# Altium schematic sheet Power_External_Connectors.SchDoc
size B
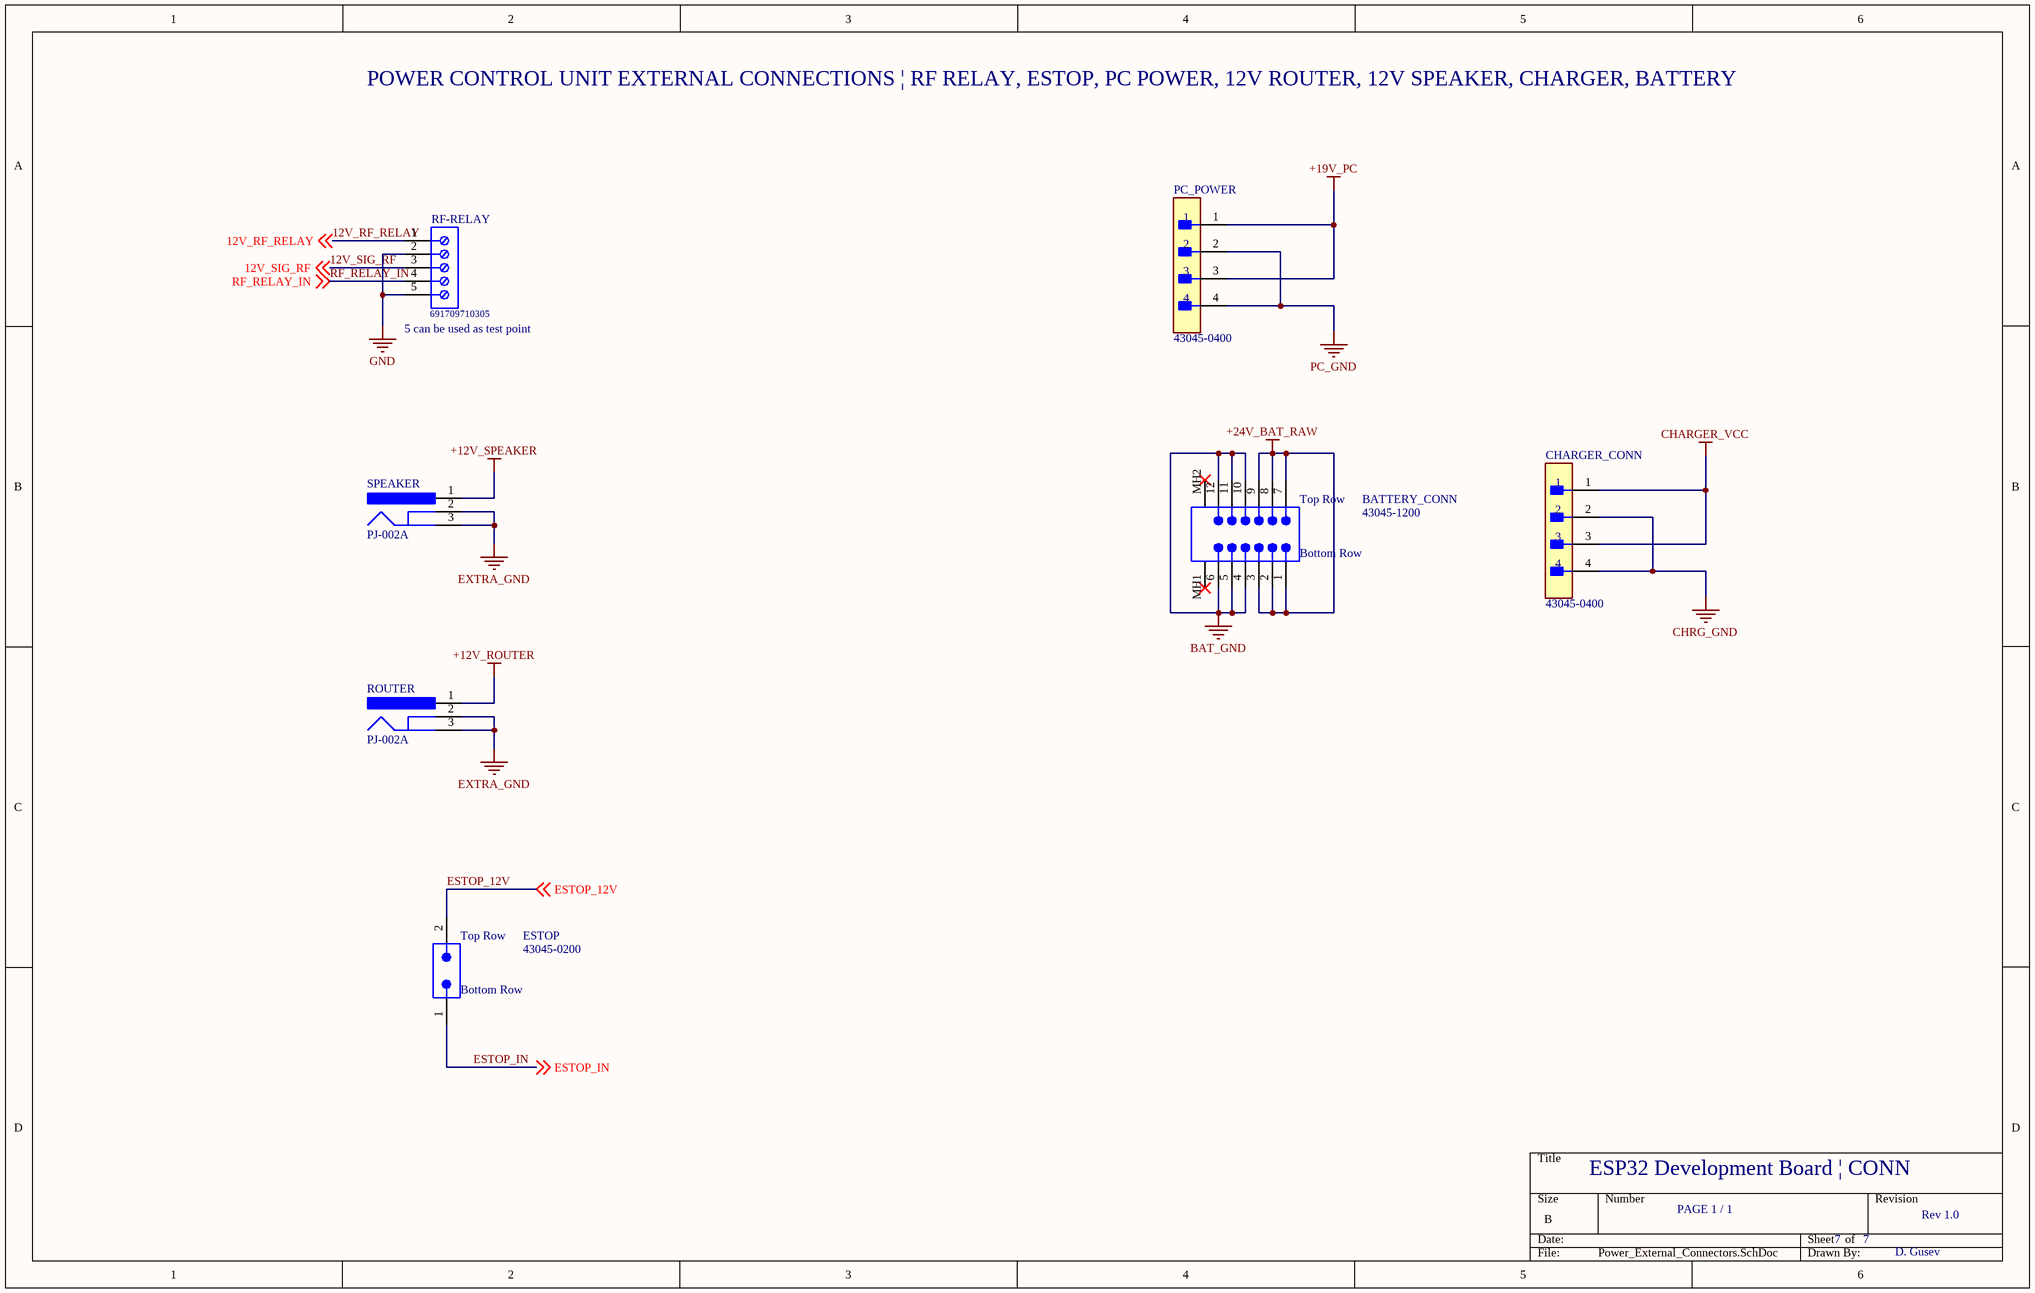
[diagram p0: Power_External_Connectors.SchDoc]

## Parts
BATTERY_CONN  43045-1200  [MOLX-43045-1200]
CHARGER_CONN  43045-0400  [FP-43045-0400-MFG]
ESTOP  43045-0200  [MOLX-43045-0200]
PC_POWER  43045-0400  [FP-43045-0400-MFG]
RF-RELAY  691709710305  [691709710305]
ROUTER  PJ-002A  [CUI-PJ-002A_V]
SPEAKER  PJ-002A  [CUI-PJ-002A_V]

## Nets
+12V_ROUTER: ROUTER.1
+12V_SPEAKER: SPEAKER.1
+19V_PC: PC_POWER.1 PC_POWER.3
+24V_BAT_RAW: BATTERY_CONN.1 BATTERY_CONN.2 BATTERY_CONN.3 BATTERY_CONN.7 BATTERY_CONN.8 BATTERY_CONN.9
BAT_GND: BATTERY_CONN.4 BATTERY_CONN.5 BATTERY_CONN.6 BATTERY_CONN.10 BATTERY_CONN.11 BATTERY_CONN.12
CHARGER_VCC: CHARGER_CONN.1 CHARGER_CONN.3
CHRG_GND: CHARGER_CONN.2 CHARGER_CONN.4
EXTRA_GND: ROUTER.2 ROUTER.3 SPEAKER.2 SPEAKER.3
GND: RF-RELAY.2 RF-RELAY.5
PC_GND: PC_POWER.2 PC_POWER.4
12V_RF_RELAY: RF-RELAY.1 ; off-sheet 12V_RF_RELAY
12V_SIG_RF: RF-RELAY.3 ; off-sheet 12V_SIG_RF
ESTOP_12V: ESTOP.2 ; off-sheet ESTOP_12V
ESTOP_IN: ESTOP.1 ; off-sheet ESTOP_IN
RF_RELAY_IN: RF-RELAY.4 ; off-sheet RF_RELAY_IN

Not connected (* = marked no-connect by the designer): BATTERY_CONN MH1* MH2*

## Notes on the sheet
- POWER CONTROL UNIT EXTERNAL CONNECTIONS | RF RELAY, ESTOP, PC POWER, 12V ROUTER, 12V SPEAKER, CHARGER, BATTERY
- (near RF-RELAY) 5 can be used as test point
- ESP32 Development Board | CONN
- PAGE 1 / 1
- 7
- Rev 1.0
- D. Gusev
- (in symbol Molex 0430450-200) Top Row; Bottom Row
- (in symbol Molex 0430451-200) Top Row; Bottom Row

## Library data of the parts
BATTERY_CONN = Molex 0430451-200: 3 mm Pitch Micro-Fit 3.0 Connector, 17.27 mm Mated Height, Vertical, Through Hole, 12 Circuits, -40 to 105 degC, RoHS, Tray; PartNumber: 43045-0812; Pitch: 3 mm; No. of Positions: 8; No. of Rows: 2; ComponentLink2Description: Datasheet; ComponentLink2URL: http://www.molex.com/webdocs/datasheets/pdf/en-us/0430450812_PCB_HEADERS.pdf; Orientation: Vertical; Packing: Tray; Temperature Min: -40 degC; RoHS: TRUE; ComponentLink3Description: Package Specification; Temperature Max: 105 degC; ComponentLink3URL: http://www.molex.com/pdm_docs/sd/430450812_sd.pdf; Mounting Technology: Through Hole; PackageVersion: Rev. F, 06/2009; ComponentLink1Description: Manufacturer URL; PackageDescription: 8-Pin PCB Header, Vertical, Pitch 3 mm, Mated Height 17.27 mm, Through Hole; ComponentLink1URL: http://www.molex.com/
CHARGER_CONN PC_POWER = CMP-04776-000002-1: CONN HEADER R/A 4POS 3MM; Manufacturer: Molex; Conn Gender: Male; Conn Orientation: Right Angle; Voltage Rating: 600V; Number Of Contacts: 4; Is Female: yes; Current Rating: 8.5A; ComponentLink2URL: https://www.molex.com/webdocs/datasheets/pdf/en-us/0430450400_PCB_HEADERS.pdf; Manufacturer Part Number: 43045-0400; Digikey Description: CONN HEADER R/A 4POS 3MM; Category: Conn; Temperature Range High: +105°C; Lead Free: Yes; Device Class L1: Connectors; Automotive: No; Temperature: -40°C to +105°C; Footprint Url: https://www.molex.com/pdm_docs/sd/430450400_sd.pdf; Height: 9.27mm; Number Of Rows: 2; Device Class L3: unset; Pitch: 3mm; Temperature Range Low: -40°C; Contact Material: Tin,Nickel; Octopart: https://octopart.com/43045-0400-molex-287063; RoHS: TRUE; ComponentLink2Description: Datasheet; Package: 43045-0400; Device Class L2: Headers and Wire Housings
ESTOP = Molex 0430450-200: 3 mm Pitch Micro-Fit 3.0 Connector, 17.27 mm Mated Height, Vertical, Through Hole, 2 Circuits, -40 to 105 degC, RoHS, Tray; PartNumber: 43045-0812; Pitch: 3 mm; No. of Positions: 8; No. of Rows: 2; ComponentLink2Description: Datasheet; ComponentLink2URL: http://www.molex.com/webdocs/datasheets/pdf/en-us/0430450812_PCB_HEADERS.pdf; Orientation: Vertical; Packing: Tray; Temperature Min: -40 degC; RoHS: TRUE; ComponentLink3Description: Package Specification; Temperature Max: 105 degC; ComponentLink3URL: http://www.molex.com/pdm_docs/sd/430450812_sd.pdf; Mounting Technology: Through Hole; PackageVersion: Rev. F, 06/2009; ComponentLink1Description: Manufacturer URL; PackageDescription: 8-Pin PCB Header, Vertical, Pitch 3 mm, Mated Height 17.27 mm, Through Hole; ComponentLink1URL: http://www.molex.com/
RF-RELAY = CMP-1502-03338-1: Serie 7097 - 5.00 mm Horizontal Entry SMT with Pressure Clamp WR-TBL, 5 pin; Manufacturer: Wurth Elektronik; Pitch: 5.00mm; Pin Number: 5; Packaging: TapeandReelwithCap; Operating Temperature: -45to130degC; Mounting Technology: SMT; Part Number: 691709710305; Publisher: WurthElektronik; Manufacturer URL: http://www.we-online.de; Datasheet URL: http://katalog.we-online.de/em/datasheet/6917097103xx.pdf; Package Reference: 691709710305
ROUTER SPEAKER = CMP-2000-06895-1: Through Hole Right Angle DC Power Jack, 2.5 A, 2 mm Center Pin, 3 Position, -25 to 85 degC, RoHS, Bulk; Manufacturer: CUIInc.; Current Rating: 2.5A; Inside Contact Diameter: 2mm; Insulation Resistance: 50MOhms; Outside Contact Diameter: 6.5mm; Voltage Rating: 24V; Brand: CUI; Operating Temperature Range: -25Cto+85C; Mounting Technology: ThroughHole; Connector Type: DCPowerJack; Contact Material: Copper; Datasheet URL: http://www.cui.com/product/resource/pj-002a.pdf; Contact Gender: Male; Housing Material: PolybutyleneTerephthalate(PBT); Manufacturer URL: http://www.cui.com/; Package Reference: PJ-002A; Mounting Style: ThroughHole; Mounting Angle: Right; Product Category: DCPowerConnectors; Product: Jacks; Flammability Rating: UL94V-0; Contact Plating: Nickel; RoHS: True; Datasheet Version: Rev. 1.03, 04/2016; Package Description: 3-Pin Through Hole Device, Body 14.4 x 9 mm, Height 11 mm; Factory Pack Quantity: 500; Termination Style: ThroughHole